# EAGLE schematic fmc (EAGLE 9.3.2)
CREVISION: v0a; DESIGNER: Rafael Silva

## Sheet 1 of 5: Main Controller
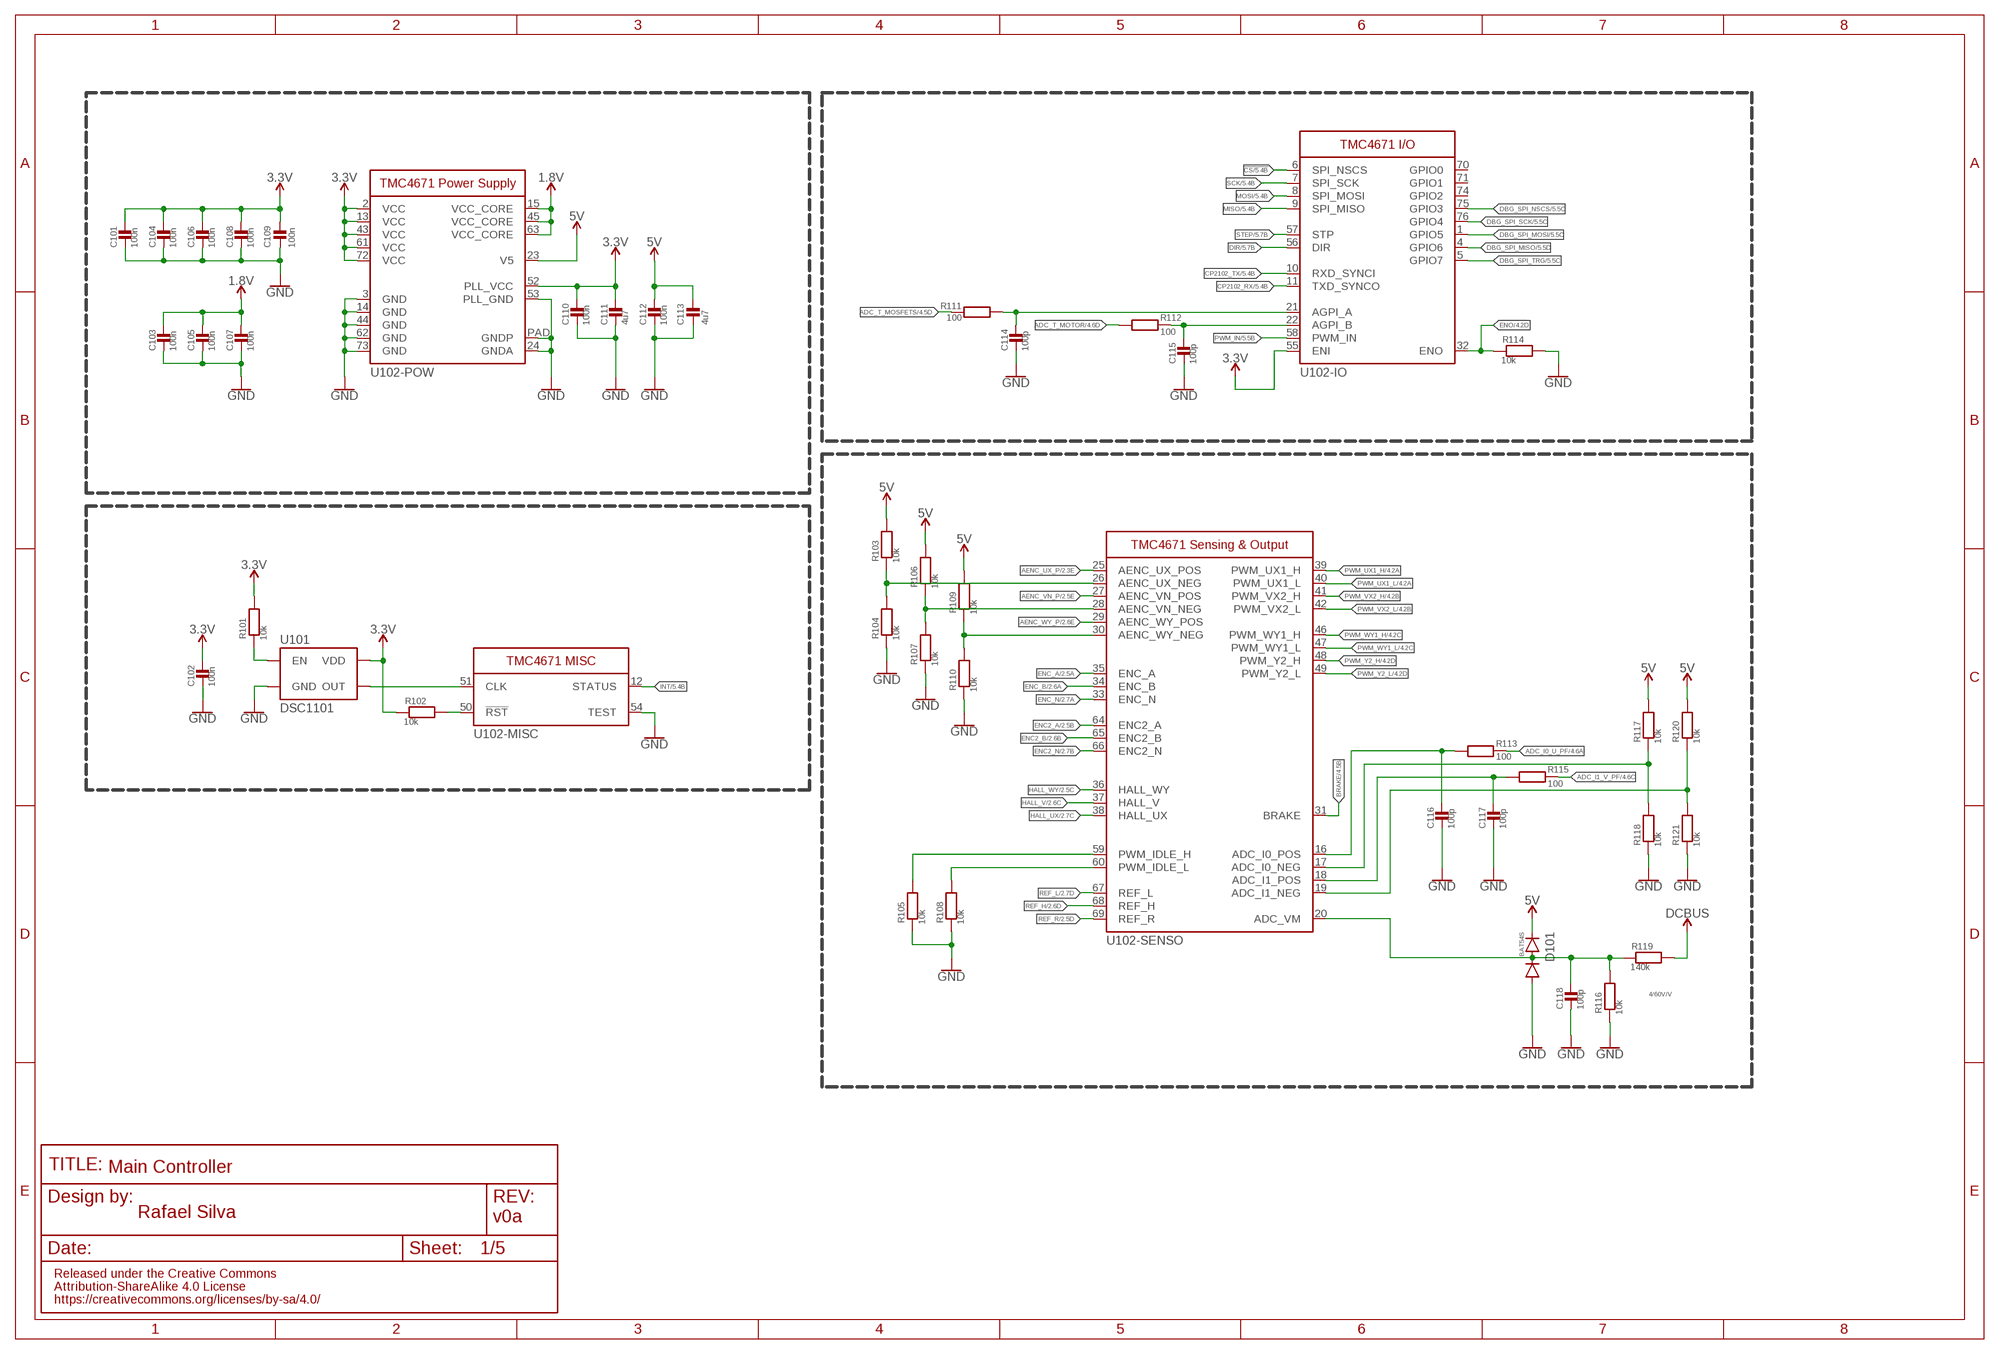
[diagram p0: schematic, sheet 1]

### Parts
C101  100n  MLCC0603  [0603_WAVE]
C102  100n  MLCC0603  [0603_WAVE]
C103  100n  MLCC0603  [0603_WAVE]
C104  100n  MLCC0603  [0603_WAVE]
C105  100n  MLCC0603  [0603_WAVE]
C106  100n  MLCC0603  [0603_WAVE]
C107  100n  MLCC0603  [0603_WAVE]
C108  100n  MLCC0603  [0603_WAVE]
C109  100n  MLCC0603  [0603_WAVE]
C110  100n  MLCC0603  [0603_WAVE]
C111  4u7  MLCC0603  [0603_WAVE]
C112  100n  MLCC0603  [0603_WAVE]
C113  4u7  MLCC0603  [0603_WAVE]
C114  100p  MLCC0603  [0603_WAVE]
C115  100p  MLCC0603  [0603_WAVE]
C116  100p  MLCC0603  [0603_WAVE]
C117  100p  MLCC0603  [0603_WAVE]
C118  100p  MLCC0603  [0603_WAVE]
D101  BAT54S  [SOT-23-3]
R101  10k  RESISTOR0603  [0603_WAVE]
R102  10k  RESISTOR0603  [0603_WAVE]
R103  10k  RESISTOR0603  [0603_WAVE]
R104  10k  RESISTOR0603  [0603_WAVE]
R105  10k  RESISTOR0603  [0603_WAVE]
R106  10k  RESISTOR0603  [0603_WAVE]
R107  10k  RESISTOR0603  [0603_WAVE]
R108  10k  RESISTOR0603  [0603_WAVE]
R109  10k  RESISTOR0603  [0603_WAVE]
R110  10k  RESISTOR0603  [0603_WAVE]
R111  100  RESISTOR0603  [0603_WAVE]
R112  100  RESISTOR0603  [0603_WAVE]
R113  100  RESISTOR0603  [0603_WAVE]
R114  10k  RESISTOR0603  [0603_WAVE]
R115  100  RESISTOR0603  [0603_WAVE]
R116  10k  RESISTOR0603  [0603_WAVE]
R117  10k  RESISTOR0603  [0603_WAVE]
R118  10k  RESISTOR0603  [0603_WAVE]
R119  140k  RESISTOR0603  [0603_WAVE]
R120  10k  RESISTOR0603  [0603_WAVE]
R121  10k  RESISTOR0603  [0603_WAVE]
U101  DSC1101  [CDFN_5X3.2]
U102  TMC4671  [QFN76]

### Nets
1.8V: C103.P$1 C105.P$1 C107.P$1 U102.15(-POW:VCC_CORE) U102.45(-POW:VCC_CORE) U102.63(-POW:VCC_CORE)
3.3V: C101.P$1 C102.P$1 C104.P$1 C106.P$1 C108.P$1 C109.P$1 C110.P$1 C111.P$1 R101.P$2 R102.P$1 U101.6(VDD) U102.2(-POW:VCC) U102.13(-POW:VCC) U102.43(-POW:VCC) U102.52(-POW:PLL_VCC) U102.55(-IO:ENI) U102.61(-POW:VCC) U102.72(-POW:VCC) ; also sheet 2,3,4,5
5V: C112.P$1 C113.P$1 D101.P$2 R103.P$2 R106.P$2 R109.P$2 R117.P$2 R120.P$2 U102.23(-POW:V5) ; also sheet 2,3,4
!CS: U102.6(-IO:SPI_NSCS) ; also sheet 5
ADC_I0_U_PF: R113.P$2 ; also sheet 4
ADC_I1_V_PF: R115.P$2 ; also sheet 4
ADC_T_MOSFETS: R111.P$2 ; also sheet 4
ADC_T_MOTOR: R112.P$1 ; also sheet 4
AENC_UX_P: U102.25(-SENSO:AENC_UX_POS) ; also sheet 2
AENC_VN_P: U102.27(-SENSO:AENC_VN_POS) ; also sheet 2
AENC_WY_P: U102.29(-SENSO:AENC_WY_POS) ; also sheet 2
BRAKE: U102.31(-SENSO:BRAKE) ; also sheet 4
CP2102_RX: U102.11(-IO:TXD_SYNCO) ; also sheet 5
CP2102_TX: U102.10(-IO:RXD_SYNCI) ; also sheet 5
DBG_SPI_MISO: U102.4(-IO:GPIO6) ; also sheet 5
DBG_SPI_MOSI: U102.1(-IO:GPIO5) ; also sheet 5
DBG_SPI_NSCS: U102.75(-IO:GPIO3) ; also sheet 5
DBG_SPI_SCK: U102.76(-IO:GPIO4) ; also sheet 5
DBG_SPI_TRG: U102.5(-IO:GPIO7) ; also sheet 5
DCBUS: R119.P$2 ; also sheet 3,4
DIR: U102.56(-IO:DIR) ; also sheet 5
ENC2_A: U102.64(-SENSO:ENC2_A) ; also sheet 2
ENC2_B: U102.65(-SENSO:ENC2_B) ; also sheet 2
ENC2_N: U102.66(-SENSO:ENC2_N) ; also sheet 2
ENC_A: U102.35(-SENSO:ENC_A) ; also sheet 2
ENC_B: U102.34(-SENSO:ENC_B) ; also sheet 2
ENC_N: U102.33(-SENSO:ENC_N) ; also sheet 2
ENO: R114.P$1 U102.32(-IO:ENO) ; also sheet 4
GND: C101.P$2 C102.P$2 C103.P$2 C104.P$2 C105.P$2 C106.P$2 C107.P$2 C108.P$2 C109.P$2 C110.P$2 C111.P$2 C112.P$2 C113.P$2 C114.P$2 C115.P$2 C116.P$2 C117.P$2 C118.P$2 D101.P$1 R104.P$1 R105.P$1 R107.P$1 R108.P$1 R110.P$1 R114.P$2 R116.P$1 R118.P$1 R121.P$1 U101.3(GND) U102.3(-POW:GND) U102.14(-POW:GND) U102.24(-POW:GNDA) U102.44(-POW:GND) U102.53(-POW:PLL_GND) U102.54(-MISC:TEST) U102.62(-POW:GND) U102.73(-POW:GND) U102.PAD(-POW:GNDP) ; also sheet 2,3,4,5
HALL_UX: U102.38(-SENSO:HALL_UX) ; also sheet 2
HALL_V: U102.37(-SENSO:HALL_V) ; also sheet 2
HALL_WY: U102.36(-SENSO:HALL_WY) ; also sheet 2
INT: U102.12(-MISC:STATUS) ; also sheet 5
MISO: U102.9(-IO:SPI_MISO) ; also sheet 5
MOSI: U102.8(-IO:SPI_MOSI) ; also sheet 5
N$2: C116.P$1 R113.P$1 U102.16(-SENSO:ADC_I0_POS)
N$38: R108.P$2 U102.60(-SENSO:PWM_IDLE_L)
N$39: R105.P$2 U102.59(-SENSO:PWM_IDLE_H)
N$41: U101.4(OUT) U102.51(-MISC:CLK)
N$42: R102.P$2 U102.50(-MISC:!RST!)
N$44: R101.P$1 U101.1(EN)
N$51: C117.P$1 R115.P$1 U102.18(-SENSO:ADC_I1_POS)
N$52: R117.P$1 R118.P$2 U102.17(-SENSO:ADC_I0_NEG)
N$53: R120.P$1 R121.P$2 U102.19(-SENSO:ADC_I1_NEG)
N$54: C118.P$1 D101.P$3 R116.P$2 R119.P$1 U102.20(-SENSO:ADC_VM)
N$92: C114.P$1 R111.P$1 U102.21(-IO:AGPI_A)
N$93: C115.P$1 R112.P$2 U102.22(-IO:AGPI_B)
N$94: R109.P$1 R110.P$2 U102.30(-SENSO:AENC_WY_NEG)
N$95: R106.P$1 R107.P$2 U102.28(-SENSO:AENC_VN_NEG)
N$96: R103.P$1 R104.P$2 U102.26(-SENSO:AENC_UX_NEG)
PWM_IN: U102.58(-IO:PWM_IN) ; also sheet 5
PWM_UX1_H: U102.39(-SENSO:PWM_UX1_H) ; also sheet 4
PWM_UX1_L: U102.40(-SENSO:PWM_UX1_L) ; also sheet 4
PWM_VX2_H: U102.41(-SENSO:PWM_VX2_H) ; also sheet 4
PWM_VX2_L: U102.42(-SENSO:PWM_VX2_L) ; also sheet 4
PWM_WY1_H: U102.46(-SENSO:PWM_WY1_H) ; also sheet 4
PWM_WY1_L: U102.47(-SENSO:PWM_WY1_L) ; also sheet 4
PWM_Y2_H: U102.48(-SENSO:PWM_Y2_H) ; also sheet 4
PWM_Y2_L: U102.49(-SENSO:PWM_Y2_L) ; also sheet 4
REF_H: U102.68(-SENSO:REF_H) ; also sheet 2
REF_L: U102.67(-SENSO:REF_L) ; also sheet 2
REF_R: U102.69(-SENSO:REF_R) ; also sheet 2
SCK: U102.7(-IO:SPI_SCK) ; also sheet 5
STEP: U102.57(-IO:STP) ; also sheet 5
Unconnected: U102.70(-IO:GPIO0) U102.71(-IO:GPIO1) U102.74(-IO:GPIO2)

### Notes on the sheet
- 4/60V/V
- Main Controller

## Sheet 2 of 5: Feedback
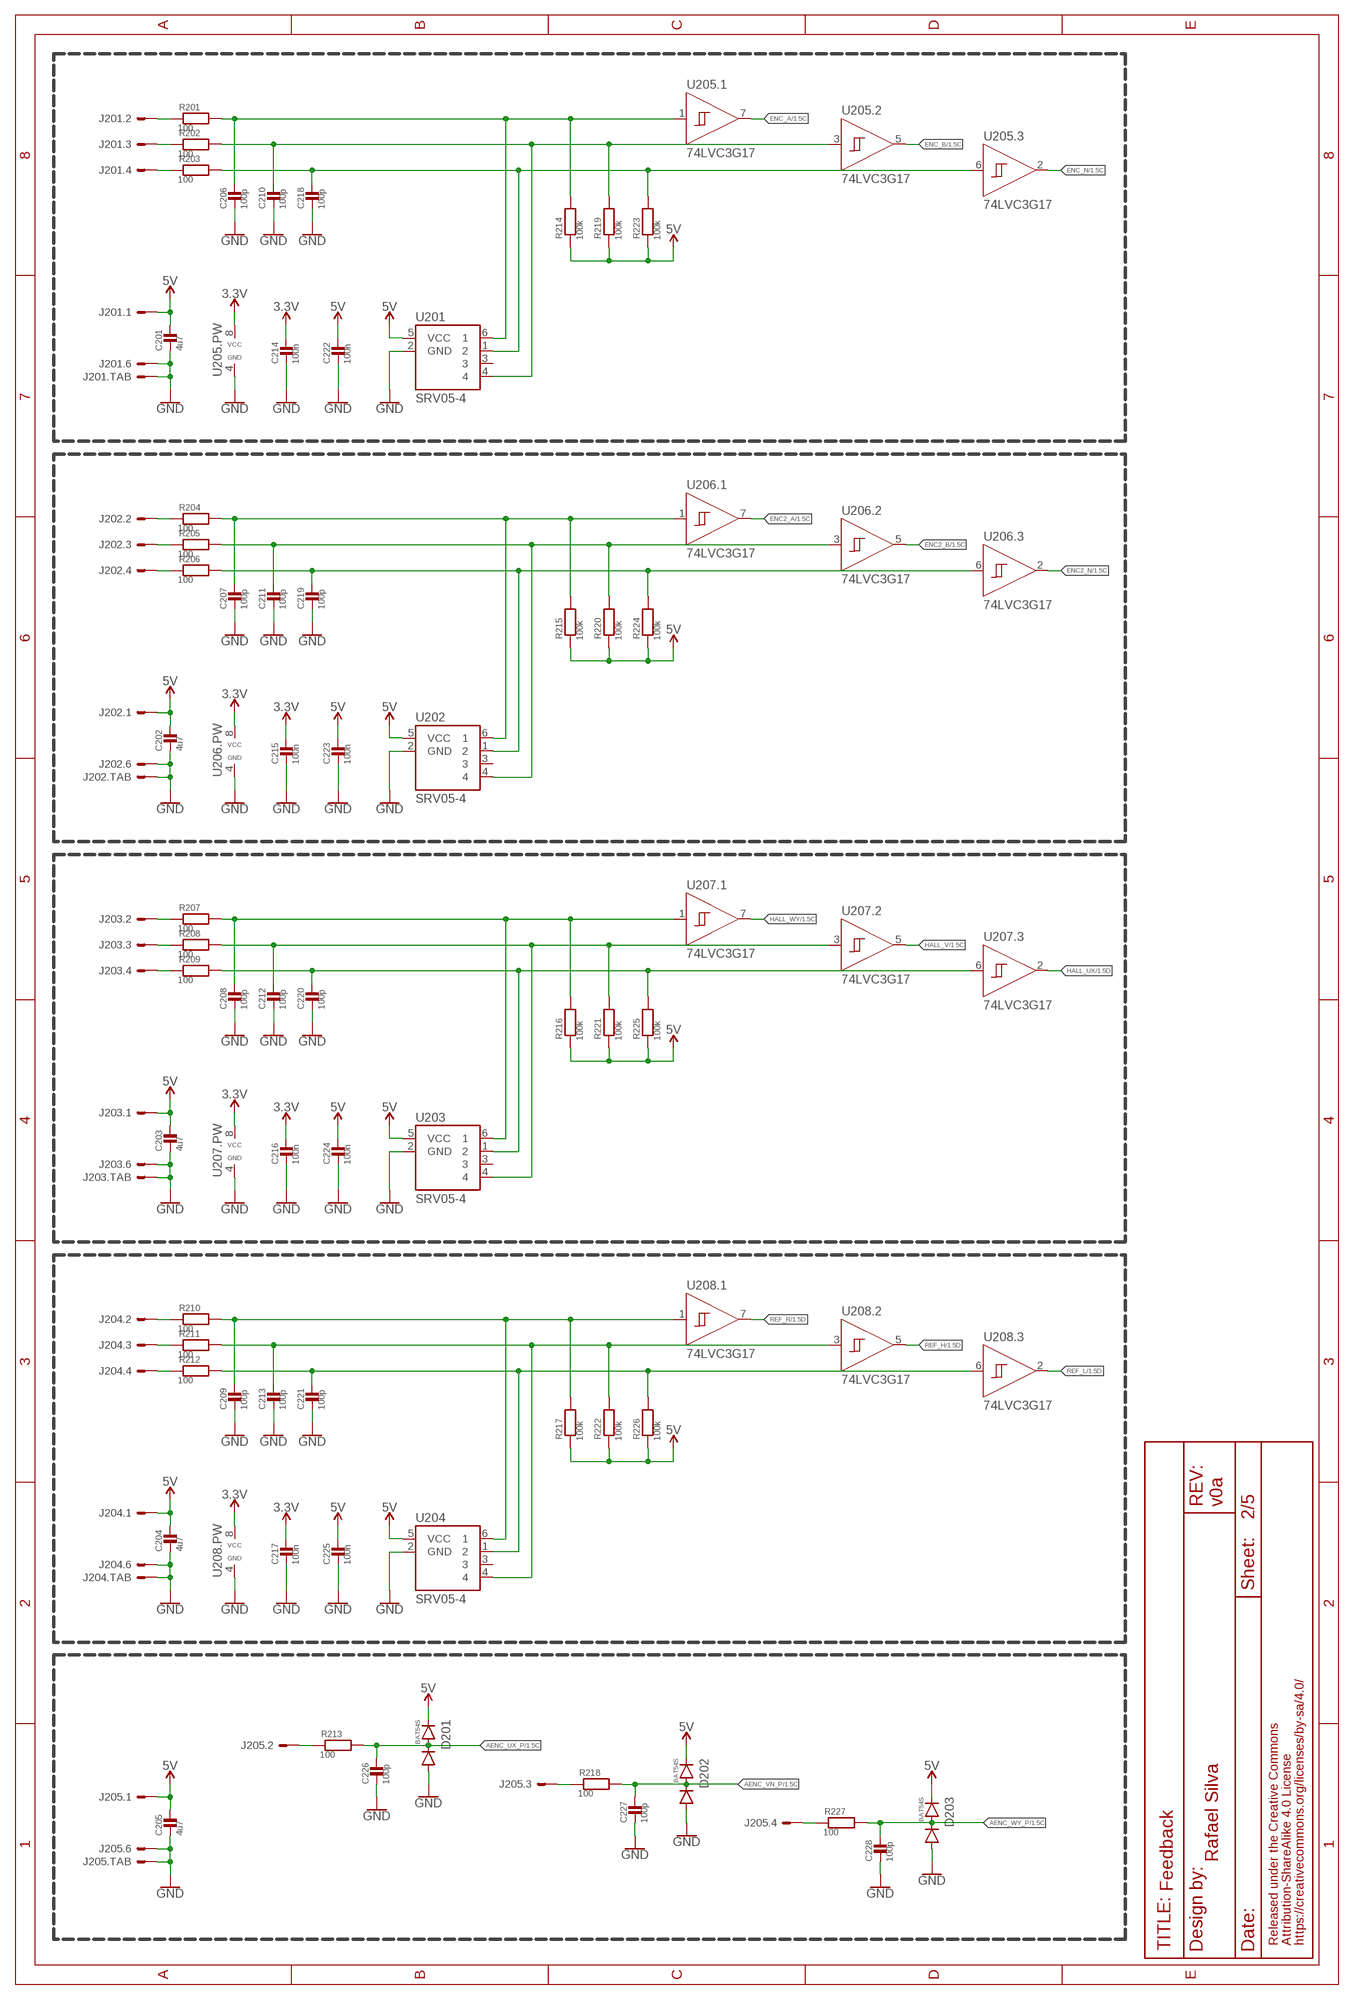
[diagram p1: schematic, sheet 2]

### Parts
C201  4u7  MLCC0603  [0603_WAVE]
C202  4u7  MLCC0603  [0603_WAVE]
C203  4u7  MLCC0603  [0603_WAVE]
C204  4u7  MLCC0603  [0603_WAVE]
C205  4u7  MLCC0603  [0603_WAVE]
C206  100p  MLCC0603  [0603_WAVE]
C207  100p  MLCC0603  [0603_WAVE]
C208  100p  MLCC0603  [0603_WAVE]
C209  100p  MLCC0603  [0603_WAVE]
C210  100p  MLCC0603  [0603_WAVE]
C211  100p  MLCC0603  [0603_WAVE]
C212  100p  MLCC0603  [0603_WAVE]
C213  100p  MLCC0603  [0603_WAVE]
C214  100n  MLCC0603  [0603_WAVE]
C215  100n  MLCC0603  [0603_WAVE]
C216  100n  MLCC0603  [0603_WAVE]
C217  100n  MLCC0603  [0603_WAVE]
C218  100p  MLCC0603  [0603_WAVE]
C219  100p  MLCC0603  [0603_WAVE]
C220  100p  MLCC0603  [0603_WAVE]
C221  100p  MLCC0603  [0603_WAVE]
C222  100n  MLCC0603  [0603_WAVE]
C223  100n  MLCC0603  [0603_WAVE]
C224  100n  MLCC0603  [0603_WAVE]
C225  100n  MLCC0603  [0603_WAVE]
C226  100p  MLCC0603  [0603_WAVE]
C227  100p  MLCC0603  [0603_WAVE]
C228  100p  MLCC0603  [0603_WAVE]
D201  BAT54S  [SOT-23-3]
D202  BAT54S  [SOT-23-3]
D203  BAT54S  [SOT-23-3]
J201  SH-5  [SM05B-SSR-H-TB]
J202  SH-5  [SM05B-SSR-H-TB]
J203  SH-5  [SM05B-SSR-H-TB]
J204  SH-5  [SM05B-SSR-H-TB]
J205  SH-5  [SM05B-SSR-H-TB]
R201  100  RESISTOR0603  [0603_WAVE]
R202  100  RESISTOR0603  [0603_WAVE]
R203  100  RESISTOR0603  [0603_WAVE]
R204  100  RESISTOR0603  [0603_WAVE]
R205  100  RESISTOR0603  [0603_WAVE]
R206  100  RESISTOR0603  [0603_WAVE]
R207  100  RESISTOR0603  [0603_WAVE]
R208  100  RESISTOR0603  [0603_WAVE]
R209  100  RESISTOR0603  [0603_WAVE]
R210  100  RESISTOR0603  [0603_WAVE]
R211  100  RESISTOR0603  [0603_WAVE]
R212  100  RESISTOR0603  [0603_WAVE]
R213  100  RESISTOR0603  [0603_WAVE]
R214  100k  RESISTOR0603  [0603_WAVE]
R215  100k  RESISTOR0603  [0603_WAVE]
R216  100k  RESISTOR0603  [0603_WAVE]
R217  100k  RESISTOR0603  [0603_WAVE]
R218  100  RESISTOR0603  [0603_WAVE]
R219  100k  RESISTOR0603  [0603_WAVE]
R220  100k  RESISTOR0603  [0603_WAVE]
R221  100k  RESISTOR0603  [0603_WAVE]
R222  100k  RESISTOR0603  [0603_WAVE]
R223  100k  RESISTOR0603  [0603_WAVE]
R224  100k  RESISTOR0603  [0603_WAVE]
R225  100k  RESISTOR0603  [0603_WAVE]
R226  100k  RESISTOR0603  [0603_WAVE]
R227  100  RESISTOR0603  [0603_WAVE]
U201  SRV05-4  [SOT23-6]
U202  SRV05-4  [SOT23-6]
U203  SRV05-4  [SOT23-6]
U204  SRV05-4  [SOT23-6]
U205  74LVC3G17  [TSSOP-8]
U206  74LVC3G17  [TSSOP-8]
U207  74LVC3G17  [TSSOP-8]
U208  74LVC3G17  [TSSOP-8]

### Nets
3.3V: C214.P$1 C215.P$1 C216.P$1 C217.P$1 U205.8(.PW:VCC) U206.8(.PW:VCC) U207.8(.PW:VCC) U208.8(.PW:VCC) ; also sheet 1,3,4,5
5V: C201.P$1 C202.P$1 C203.P$1 C204.P$1 C205.P$1 C222.P$1 C223.P$1 C224.P$1 C225.P$1 D201.P$2 D202.P$2 D203.P$2 J201.1 J202.1 J203.1 J204.1 J205.1 R214.P$1 R215.P$1 R216.P$1 R217.P$1 R219.P$1 R220.P$1 R221.P$1 R222.P$1 R223.P$1 R224.P$1 R225.P$1 R226.P$1 U201.5(VCC) U202.5(VCC) U203.5(VCC) U204.5(VCC) ; also sheet 1,3,4
AENC_UX@J: J205.2 R213.P$1
AENC_UX_P: C226.P$1 D201.P$3 R213.P$2 ; also sheet 1
AENC_VN@J: J205.3 R218.P$1
AENC_VN_P: C227.P$1 D202.P$3 R218.P$2 ; also sheet 1
AENC_WY@J: J205.4 R227.P$1
AENC_WY_P: C228.P$1 D203.P$3 R227.P$2 ; also sheet 1
ENC2_A: U206.7(.1:Y) ; also sheet 1
ENC2_B: U206.5(.2:Y) ; also sheet 1
ENC2_N: U206.2(.3:Y) ; also sheet 1
ENC_2_A@J: J202.2 R204.P$1
ENC_2_B@J: J202.3 R205.P$1
ENC_2_N@J: J202.4 R206.P$1
ENC_A: U205.7(.1:Y) ; also sheet 1
ENC_A@J: J201.2 R201.P$1
ENC_B: U205.5(.2:Y) ; also sheet 1
ENC_B@J: J201.3 R202.P$1
ENC_N: U205.2(.3:Y) ; also sheet 1
ENC_N@J: J201.4 R203.P$1
GND: C201.P$2 C202.P$2 C203.P$2 C204.P$2 C205.P$2 C206.P$2 C207.P$2 C208.P$2 C209.P$2 C210.P$2 C211.P$2 C212.P$2 C213.P$2 C214.P$2 C215.P$2 C216.P$2 C217.P$2 C218.P$2 C219.P$2 C220.P$2 C221.P$2 C222.P$2 C223.P$2 C224.P$2 C225.P$2 C226.P$2 C227.P$2 C228.P$2 D201.P$1 D202.P$1 D203.P$1 J201.5 J201.FIT@1 J201.FIT@2 J202.5 J202.FIT@1 J202.FIT@2 J203.5 J203.FIT@1 J203.FIT@2 J204.5 J204.FIT@1 J204.FIT@2 J205.5 J205.FIT@1 J205.FIT@2 U201.2(GND) U202.2(GND) U203.2(GND) U204.2(GND) U205.4(.PW:GND) U206.4(.PW:GND) U207.4(.PW:GND) U208.4(.PW:GND) ; also sheet 1,3,4,5
HALL_UX: U207.2(.3:Y) ; also sheet 1
HALL_UX@J: J203.4 R209.P$1
HALL_V: U207.5(.2:Y) ; also sheet 1
HALL_V@J: J203.3 R208.P$1
HALL_WY: U207.7(.1:Y) ; also sheet 1
HALL_WY@J: J203.2 R207.P$1
N$67: C218.P$1 R203.P$2 R223.P$2 U201.1 U205.6(.3:A)
N$69: C210.P$1 R202.P$2 R219.P$2 U201.4 U205.3(.2:A)
N$70: C219.P$1 R206.P$2 R224.P$2 U202.1 U206.6(.3:A)
N$74: C206.P$1 R201.P$2 R214.P$2 U201.6 U205.1(.1:A)
N$75: C211.P$1 R205.P$2 R220.P$2 U202.4 U206.3(.2:A)
N$79: C207.P$1 R204.P$2 R215.P$2 U202.6 U206.1(.1:A)
N$80: C220.P$1 R209.P$2 R225.P$2 U203.1 U207.6(.3:A)
N$81: C212.P$1 R208.P$2 R221.P$2 U203.4 U207.3(.2:A)
N$85: C208.P$1 R207.P$2 R216.P$2 U203.6 U207.1(.1:A)
N$86: C221.P$1 R212.P$2 R226.P$2 U204.1 U208.6(.3:A)
N$87: C213.P$1 R211.P$2 R222.P$2 U204.4 U208.3(.2:A)
N$91: C209.P$1 R210.P$2 R217.P$2 U204.6 U208.1(.1:A)
REF_H: U208.5(.2:Y) ; also sheet 1
REF_H@J: J204.3 R211.P$1
REF_L: U208.2(.3:Y) ; also sheet 1
REF_L@J: J204.4 R212.P$1
REF_R: U208.7(.1:Y) ; also sheet 1
REF_R@J: J204.2 R210.P$1
Unconnected: U201.3 U202.3 U203.3 U204.3

### Notes on the sheet
- Feedback

## Sheet 3 of 5: Power Management
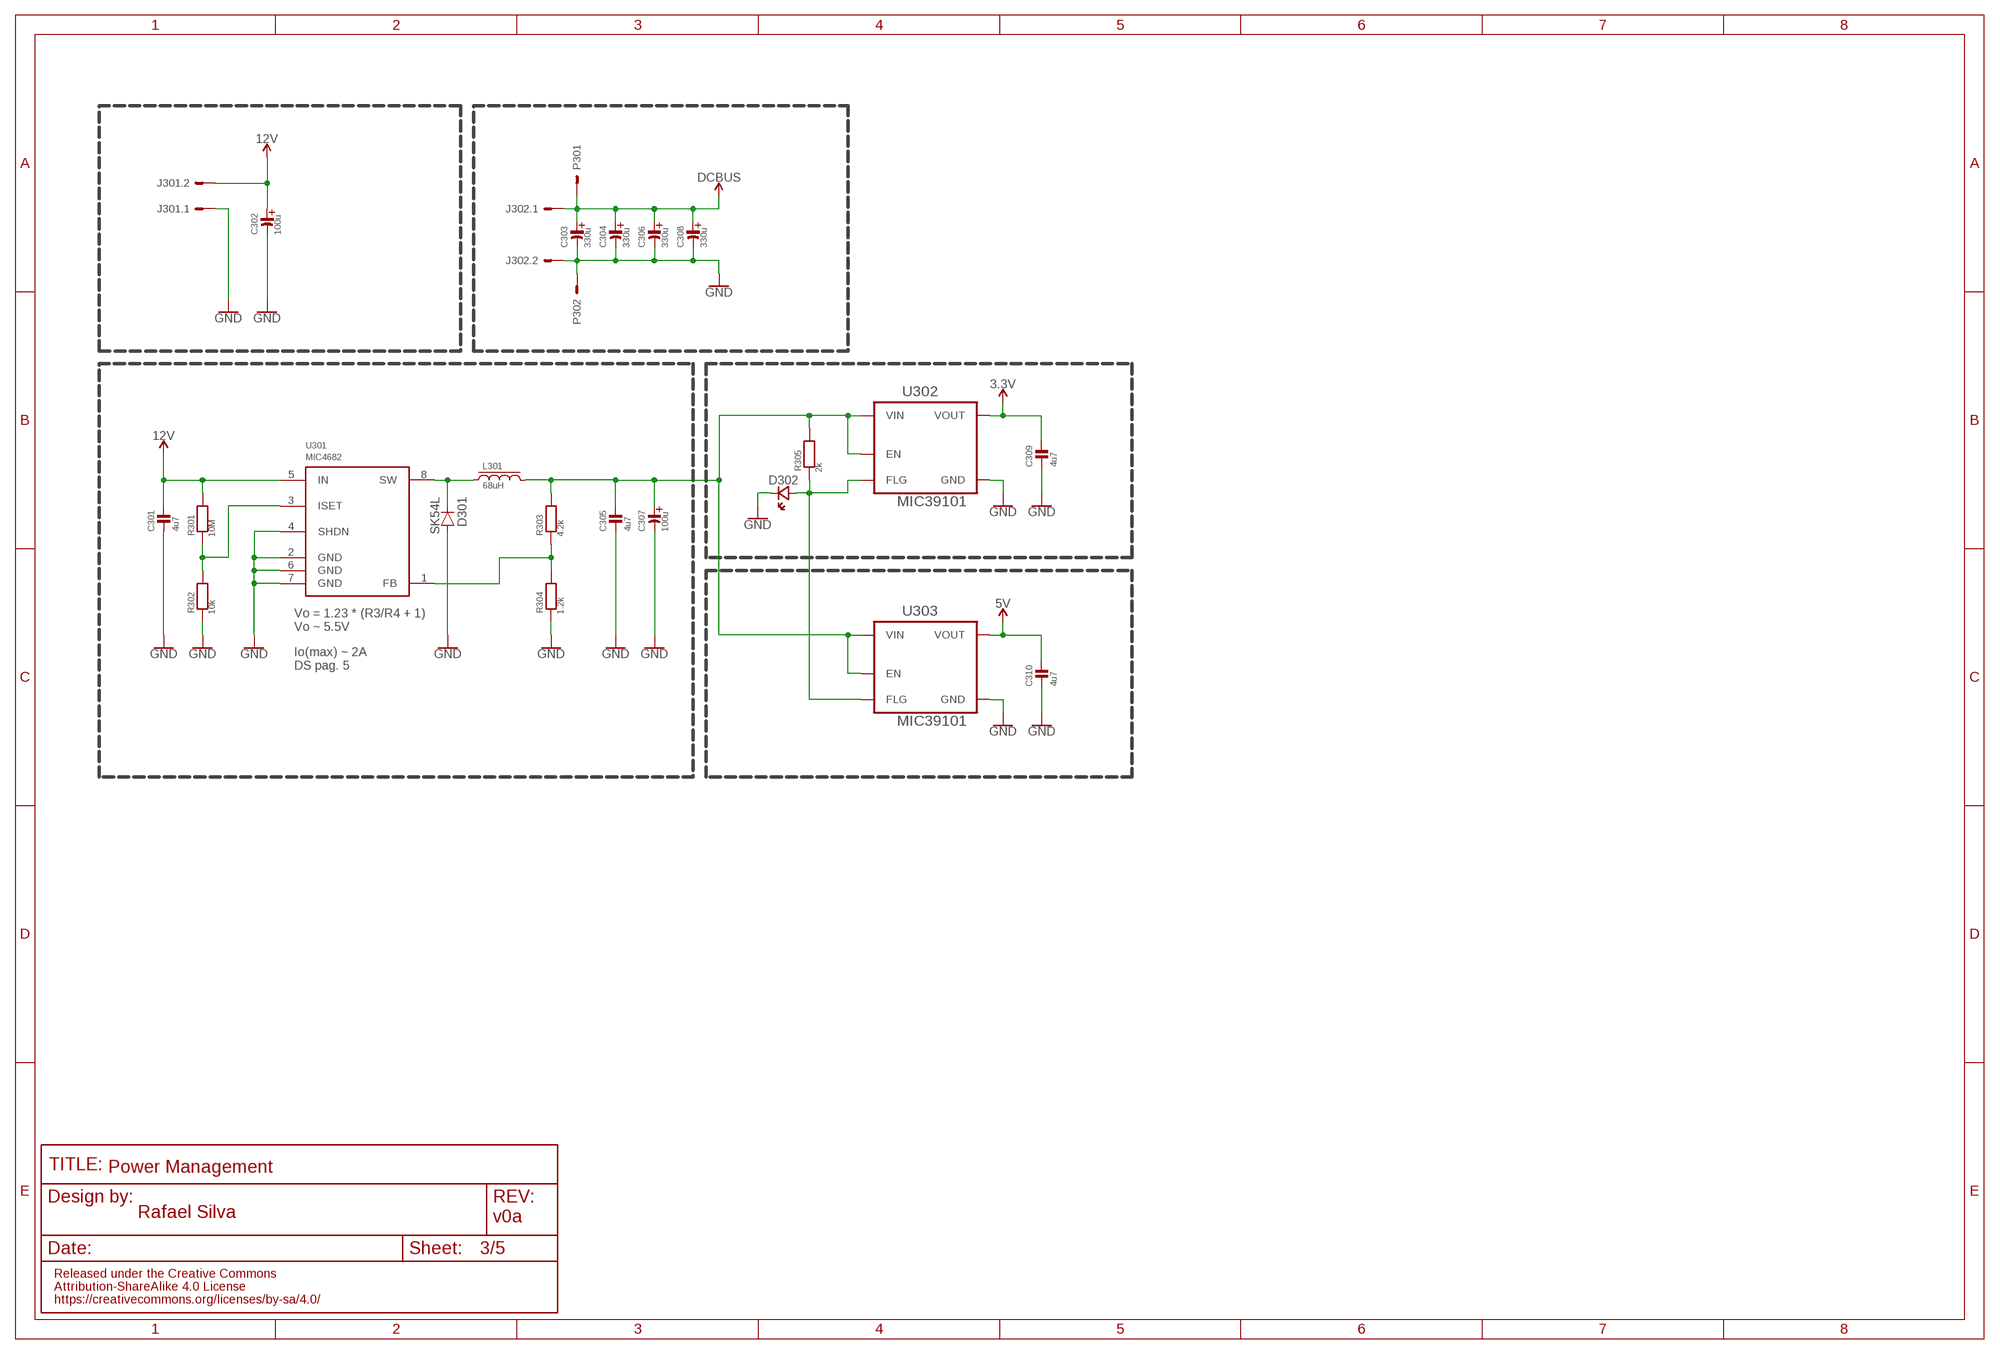
[diagram p2: schematic, sheet 3]

### Parts
C301  4u7  MLCC0603  [0603_WAVE]
C302  100u  CAPACITOR_ELD  [PANASONIC_D]
C303  330u  CAPACITOR_ELG  [PANASONIC_G]
C304  330u  CAPACITOR_ELG  [PANASONIC_G]
C305  4u7  MLCC0603  [0603_WAVE]
C306  330u  CAPACITOR_ELG  [PANASONIC_G]
C307  100u  CAPACITOR_ELD  [PANASONIC_D]
C308  330u  CAPACITOR_ELG  [PANASONIC_G]
C309  4u7  MLCC0603  [0603_WAVE]
C310  4u7  MLCC0603  [0603_WAVE]
D301  SK54L  [DO214AA]
D302  LED0603  [CHIPLED_0603]
J301  2P-6.35P  [2P-6.35P]
J302  2P-6.35P  [2P-6.35P]
L301  68uH  INDUCTORCDRH104R  [CDRH104R]
P301  POWPAD  [TH-HP]
P302  POWPAD  [TH-HP]
R301  10M  RESISTOR0603  [0603_WAVE]
R302  10k  RESISTOR0603  [0603_WAVE]
R303  4.2k  RESISTOR0603  [0603_WAVE]
R304  1.2k  RESISTOR0603  [0603_WAVE]
R305  2k  RESISTOR0603  [0603_WAVE]
U301  MIC4682  [SOIC8]
U302  MIC39101  [SOIC8]
U303  MIC39101  [SOIC8]

### Nets
3.3V: C309.P$1 U302.3(VOUT) ; also sheet 1,2,4,5
5V: C310.P$1 U303.3(VOUT) ; also sheet 1,2,4
12V: C301.P$1 C302.+(AN) J301.2 R301.P$2 U301.5(IN) ; also sheet 4
DCBUS: C303.+(AN) C304.+(AN) C306.+(AN) C308.+(AN) J302.1 P301.H1(S) P301.H2(S) P301.H3(S) P301.H4(S) P301.H5(S) P301.H6(S) P301.H7(S) P301.H8(S) P301.H9(S) P301.H10(S) P301.H11(S) P301.H12(S) P301.PAD(S) ; also sheet 1,4
GND: C301.P$2 C302.-(CA) C303.-(CA) C304.-(CA) C305.P$2 C306.-(CA) C307.-(CA) C308.-(CA) C309.P$2 C310.P$2 D301.A D302.C(CA) J301.1 J302.2 P302.H1(S) P302.H2(S) P302.H3(S) P302.H4(S) P302.H5(S) P302.H6(S) P302.H7(S) P302.H8(S) P302.H9(S) P302.H10(S) P302.H11(S) P302.H12(S) P302.PAD(S) R302.P$1 R304.P$1 U301.2(GND) U301.4(SHDN) U301.6(GND) U301.7(GND) U302.5(GND) U302.6(GND) U302.7(GND) U302.8(GND) U303.5(GND) U303.6(GND) U303.7(GND) U303.8(GND) ; also sheet 1,2,4,5
N$5: C305.P$1 C307.+(AN) L301.2 R303.P$2 R305.P$2 U302.1(EN) U302.2(VIN) U303.1(EN) U303.2(VIN)
N$45: D301.C L301.1 U301.8(SW)
N$46: R303.P$1 R304.P$2 U301.1(FB)
N$47: R301.P$1 R302.P$2 U301.3(ISET)
N$104: D302.A(AN) R305.P$1 U302.4(FLG) U303.4(FLG)

### Notes on the sheet
- Vo = 1.23 * (R3/R4 + 1)
  Vo ~ 5.5V
- Io(max) ~ 2A
  DS pag. 5
- Power Management

## Sheet 4 of 5: Power Stage
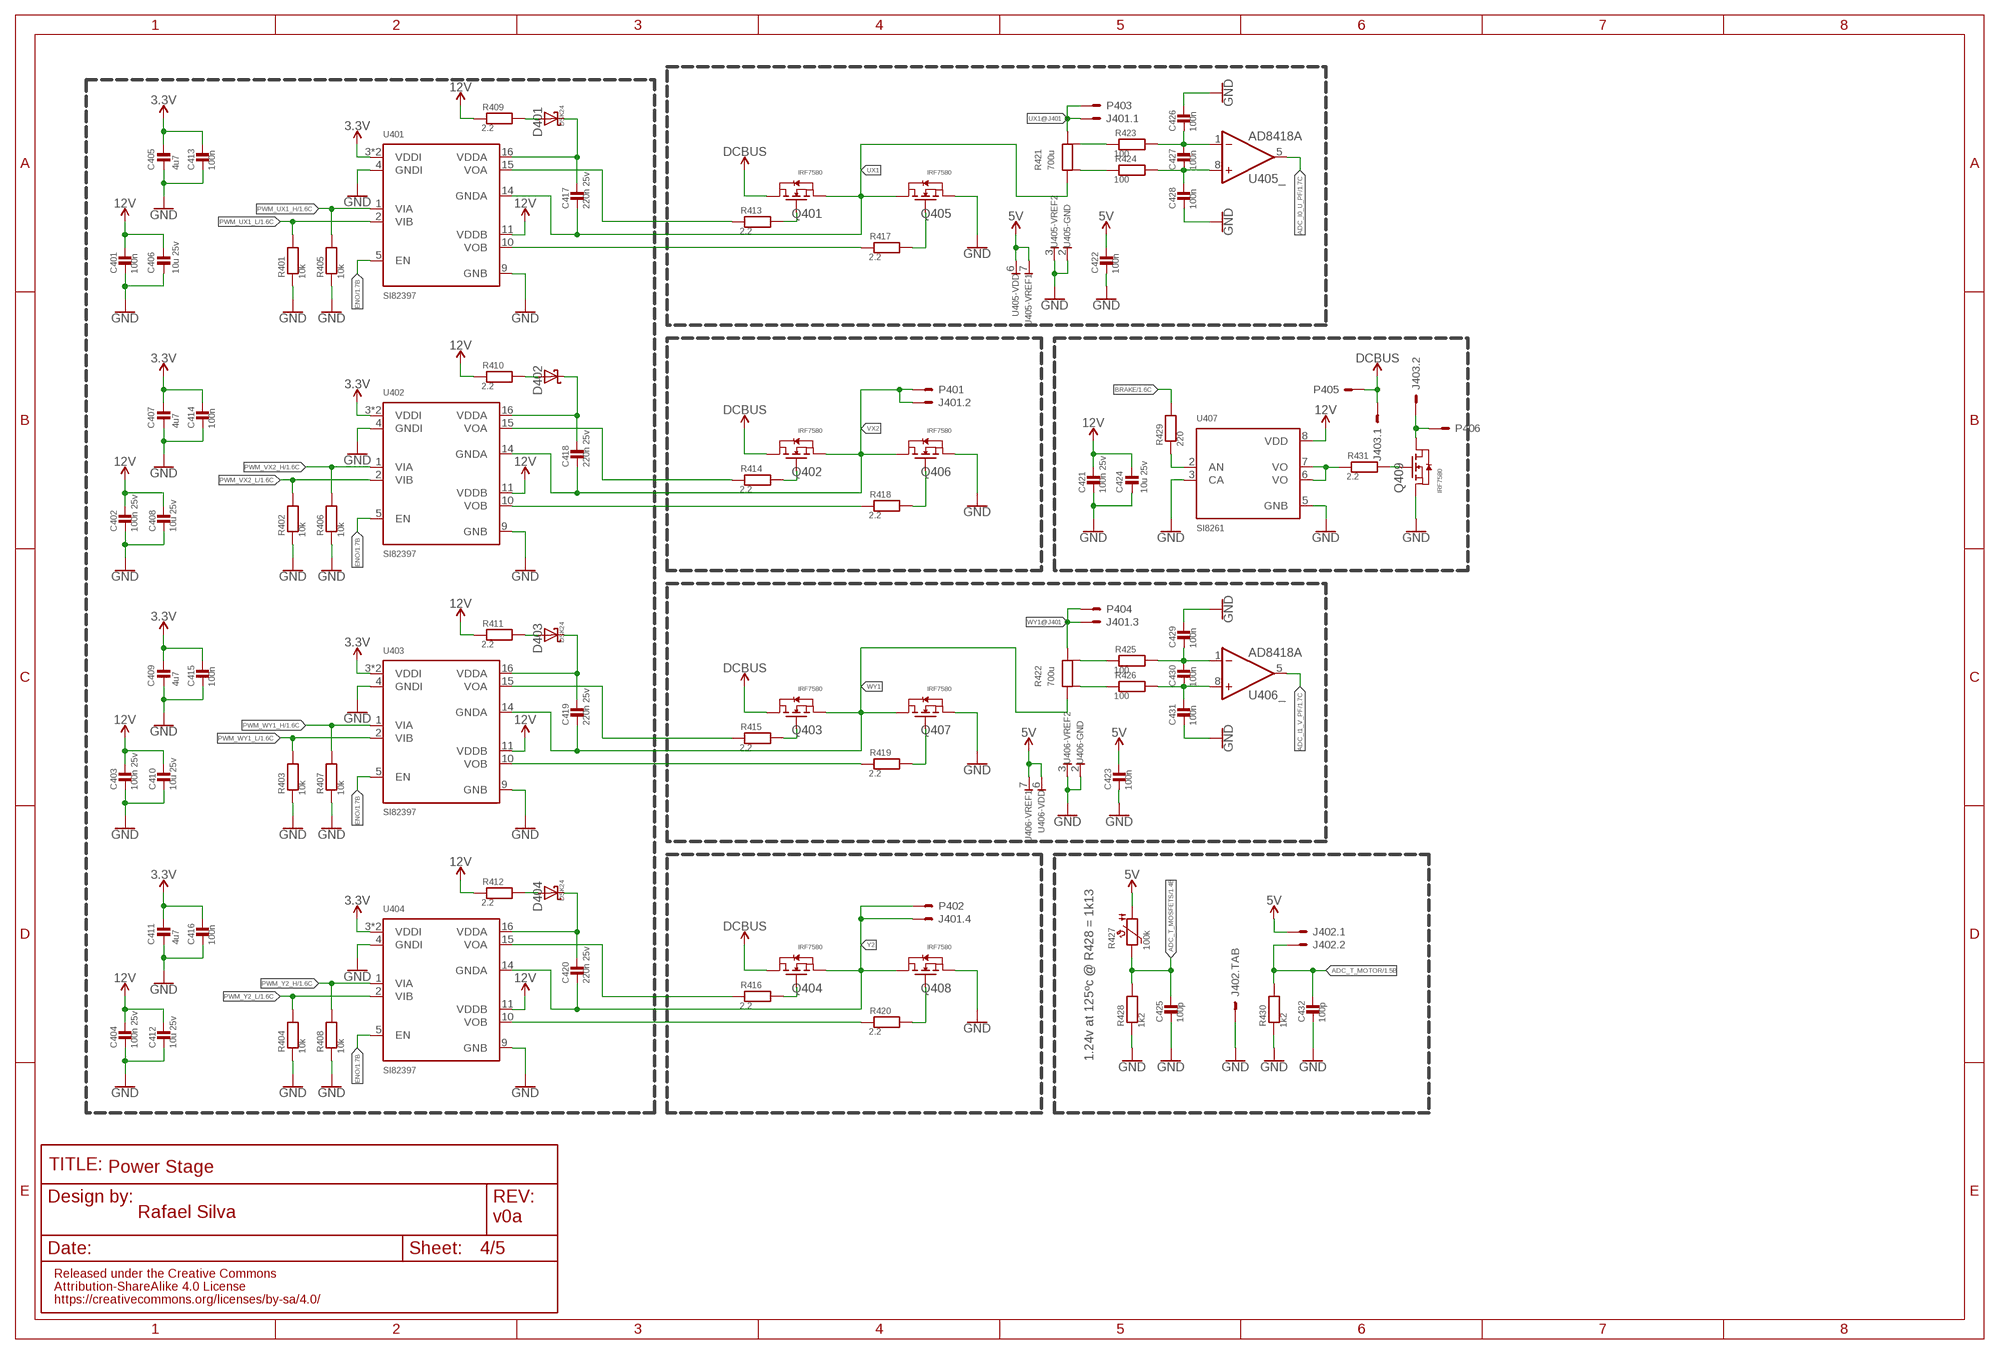
[diagram p3: schematic, sheet 4]

### Parts
C401  100n  MLCC0603  [0603_WAVE]
C402  100n 25v  MLCC0603  [0603_WAVE]
C403  100n 25v  MLCC0603  [0603_WAVE]
C404  100n 25v  MLCC0603  [0603_WAVE]
C405  4u7  MLCC0603  [0603_WAVE]
C406  10u 25v  MLCC0603  [0603_WAVE]
C407  4u7  MLCC0603  [0603_WAVE]
C408  10u 25v  MLCC0603  [0603_WAVE]
C409  4u7  MLCC0603  [0603_WAVE]
C410  10u 25v  MLCC0603  [0603_WAVE]
C411  4u7  MLCC0603  [0603_WAVE]
C412  10u 25v  MLCC0603  [0603_WAVE]
C413  100n  MLCC0603  [0603_WAVE]
C414  100n  MLCC0603  [0603_WAVE]
C415  100n  MLCC0603  [0603_WAVE]
C416  100n  MLCC0603  [0603_WAVE]
C417  220n 25v  MLCC0603  [0603_WAVE]
C418  220n 25v  MLCC0603  [0603_WAVE]
C419  220n 25v  MLCC0603  [0603_WAVE]
C420  220n 25v  MLCC0603  [0603_WAVE]
C421  100n 25v  MLCC0603  [0603_WAVE]
C422  100n  MLCC0603  [0603_WAVE]
C423  100n  MLCC0603  [0603_WAVE]
C424  10u 25v  MLCC0603  [0603_WAVE]
C425  100p  MLCC0603  [0603_WAVE]
C426  100n  MLCC0603  [0603_WAVE]
C427  100n  MLCC0603  [0603_WAVE]
C428  100n  MLCC0603  [0603_WAVE]
C429  100n  MLCC0603  [0603_WAVE]
C430  100n  MLCC0603  [0603_WAVE]
C431  100n  MLCC0603  [0603_WAVE]
C432  100p  MLCC0603  [0603_WAVE]
D401  DSK24  [SOD-123]
D402  DSK24  [SOD-123]
D403  DSK24  [SOD-123]
D404  DSK24  [SOD-123]
J401  4P-6.35P  [4P-6.35P]
J402  SH-2  [SM02B-SSR-H-TB]
J403  2P-6.35P  [2P-6.35P]
P401  POWPAD  [TH-HP]
P402  POWPAD  [TH-HP]
P403  POWPAD  [TH-HP]
P404  POWPAD  [TH-HP]
P405  POWPAD  [TH-HP]
P406  POWPAD  [TH-HP]
Q401  IRF7580  [DIRECTFET-ME]
Q402  IRF7580  [DIRECTFET-ME]
Q403  IRF7580  [DIRECTFET-ME]
Q404  IRF7580  [DIRECTFET-ME]
Q405  IRF7580  [DIRECTFET-ME]
Q406  IRF7580  [DIRECTFET-ME]
Q407  IRF7580  [DIRECTFET-ME]
Q408  IRF7580  [DIRECTFET-ME]
Q409  IRF7580  [DIRECTFET-ME]
R401  10k  RESISTOR0603  [0603_WAVE]
R402  10k  RESISTOR0603  [0603_WAVE]
R403  10k  RESISTOR0603  [0603_WAVE]
R404  10k  RESISTOR0603  [0603_WAVE]
R405  10k  RESISTOR0603  [0603_WAVE]
R406  10k  RESISTOR0603  [0603_WAVE]
R407  10k  RESISTOR0603  [0603_WAVE]
R408  10k  RESISTOR0603  [0603_WAVE]
R409  2.2  RESISTOR0603  [0603_WAVE]
R410  2.2  RESISTOR0603  [0603_WAVE]
R411  2.2  RESISTOR0603  [0603_WAVE]
R412  2.2  RESISTOR0603  [0603_WAVE]
R413  2.2  RESISTOR0603  [0603_WAVE]
R414  2.2  RESISTOR0603  [0603_WAVE]
R415  2.2  RESISTOR0603  [0603_WAVE]
R416  2.2  RESISTOR0603  [0603_WAVE]
R417  2.2  RESISTOR0603  [0603_WAVE]
R418  2.2  RESISTOR0603  [0603_WAVE]
R419  2.2  RESISTOR0603  [0603_WAVE]
R420  2.2  RESISTOR0603  [0603_WAVE]
R421  700u  LRMAP3920  [3920]
R422  700u  LRMAP3920  [3920]
R423  100  RESISTOR0603  [0603_WAVE]
R424  100  RESISTOR0603  [0603_WAVE]
R425  100  RESISTOR0603  [0603_WAVE]
R426  100  RESISTOR0603  [0603_WAVE]
R427  100k  NTC0603  [0603_WAVE]
R428  1k2  RESISTOR0603  [0603_WAVE]
R429  220  RESISTOR0603  [0603_WAVE]
R430  1k2  RESISTOR0603  [0603_WAVE]
R431  2.2  RESISTOR0603  [0603_WAVE]
U401  SI82397  [SOIC-16-WB]
U402  SI82397  [SOIC-16-WB]
U403  SI82397  [SOIC-16-WB]
U404  SI82397  [SOIC-16-WB]
U405  AD8418A  [MSOP-8]
U406  AD8418A  [MSOP-8]
U407  SI8261  [SOIC_8]

### Nets
3.3V: C405.P$1 C407.P$1 C409.P$1 C411.P$1 C413.P$1 C414.P$1 C415.P$1 C416.P$1 U401.3(VDDI) U401.8(VDDI) U402.3(VDDI) U402.8(VDDI) U403.3(VDDI) U403.8(VDDI) U404.3(VDDI) U404.8(VDDI) ; also sheet 1,2,3,5
5V: C422.P$1 C423.P$1 J402.1 R427.P$2 U405.6 U405.7 U406.6 U406.7 ; also sheet 1,2,3
12V: C401.P$1 C402.P$1 C403.P$1 C404.P$1 C406.P$1 C408.P$1 C410.P$1 C412.P$1 C421.P$1 C424.P$1 R409.P$1 R410.P$1 R411.P$1 R412.P$1 U401.11(VDDB) U402.11(VDDB) U403.11(VDDB) U404.11(VDDB) U407.8(VDD) ; also sheet 3
ADC_I0_U_PF: U405.5(_:O) ; also sheet 1
ADC_I1_V_PF: U406.5(_:O) ; also sheet 1
ADC_T_MOSFETS: C425.P$1 R427.P$1 R428.P$2 ; also sheet 1
ADC_T_MOTOR: C432.P$1 J402.2 R430.P$2 ; also sheet 1
BRAKE: R429.P$2 ; also sheet 1
DCBUS: J403.1 P405.H1(S) P405.H2(S) P405.H3(S) P405.H4(S) P405.H5(S) P405.H6(S) P405.H7(S) P405.H8(S) P405.H9(S) P405.H10(S) P405.H11(S) P405.H12(S) P405.PAD(S) Q401.D1 Q401.D2(D1) Q401.D3(D1) Q401.D4(D1) Q402.D1 Q402.D2(D1) Q402.D3(D1) Q402.D4(D1) Q403.D1 Q403.D2(D1) Q403.D3(D1) Q403.D4(D1) Q404.D1 Q404.D2(D1) Q404.D3(D1) Q404.D4(D1) ; also sheet 1,3
ENO: U401.5(EN) U402.5(EN) U403.5(EN) U404.5(EN) ; also sheet 1
GND: C401.P$2 C402.P$2 C403.P$2 C404.P$2 C405.P$2 C406.P$2 C407.P$2 C408.P$2 C409.P$2 C410.P$2 C411.P$2 C412.P$2 C413.P$2 C414.P$2 C415.P$2 C416.P$2 C421.P$2 C422.P$2 C423.P$2 C424.P$2 C425.P$2 C426.P$1 C428.P$2 C429.P$1 C431.P$2 C432.P$2 J402.FIT@1 J402.FIT@2 Q405.S1 Q405.S2(S1) Q405.S3(S1) Q405.S4(S1) Q405.S5(S1) Q406.S1 Q406.S2(S1) Q406.S3(S1) Q406.S4(S1) Q406.S5(S1) Q407.S1 Q407.S2(S1) Q407.S3(S1) Q407.S4(S1) Q407.S5(S1) Q408.S1 Q408.S2(S1) Q408.S3(S1) Q408.S4(S1) Q408.S5(S1) Q409.S1 Q409.S2(S1) Q409.S3(S1) Q409.S4(S1) Q409.S5(S1) R401.P$1 R402.P$1 R403.P$1 R404.P$1 R405.P$1 R406.P$1 R407.P$1 R408.P$1 R428.P$1 R430.P$1 U401.4(GNDI) U401.9(GNB) U402.4(GNDI) U402.9(GNB) U403.4(GNDI) U403.9(GNB) U404.4(GNDI) U404.9(GNB) U405.2 U405.3 U406.2 U406.3 U407.3(CA) U407.5(GNB) ; also sheet 1,2,3,5
N$3: R413.P$1 U401.15(VOA)
N$4: Q405.G(G1) R417.P$2
N$6: R421.SENSE+ R424.P$1
N$7: C417.P$1 D401.C U401.16(VDDA)
N$8: R414.P$1 U402.15(VOA)
N$9: Q406.G(G1) R418.P$2
N$10: R421.SENSE- R423.P$1
N$11: C418.P$1 D402.C U402.16(VDDA)
N$12: R415.P$1 U403.15(VOA)
N$13: Q407.G(G1) R419.P$2
N$14: C426.P$2 C427.P$1 R423.P$2 U405.1(_:IN-)
N$15: C419.P$1 D403.C U403.16(VDDA)
N$16: R416.P$1 U404.15(VOA)
N$17: Q408.G(G1) R420.P$2
N$18: C427.P$2 C428.P$1 R424.P$2 U405.8(_:IN+)
N$19: C420.P$1 D404.C U404.16(VDDA)
N$20: Q403.G(G1) R415.P$2
N$21: Q401.G(G1) R413.P$2
N$22: Q402.G(G1) R414.P$2
N$23: Q404.G(G1) R416.P$2
N$24: R417.P$1 U401.10(VOB)
N$25: R418.P$1 U402.10(VOB)
N$26: R419.P$1 U403.10(VOB)
N$27: R420.P$1 U404.10(VOB)
N$40: D404.A R412.P$2
N$43: D403.A R411.P$2
N$48: D402.A R410.P$2
N$49: D401.A R409.P$2
N$55: R422.SENSE- R425.P$1
N$56: R422.SENSE+ R426.P$1
N$57: C430.P$2 C431.P$1 R426.P$2 U406.8(_:IN+)
N$58: C429.P$2 C430.P$1 R425.P$2 U406.1(_:IN-)
N$100: R429.P$1 U407.2(AN)
N$102: Q409.G(G1) R431.P$2
N$103: R431.P$1 U407.6(VO) U407.7(VO)
N$105: J403.2 P406.H1(S) P406.H2(S) P406.H3(S) P406.H4(S) P406.H5(S) P406.H6(S) P406.H7(S) P406.H8(S) P406.H9(S) P406.H10(S) P406.H11(S) P406.H12(S) P406.PAD(S) Q409.D1 Q409.D2(D1) Q409.D3(D1) Q409.D4(D1)
PWM_UX1_H: R405.P$2 U401.1(VIA) ; also sheet 1
PWM_UX1_L: R401.P$2 U401.2(VIB) ; also sheet 1
PWM_VX2_H: R406.P$2 U402.1(VIA) ; also sheet 1
PWM_VX2_L: R402.P$2 U402.2(VIB) ; also sheet 1
PWM_WY1_H: R407.P$2 U403.1(VIA) ; also sheet 1
PWM_WY1_L: R403.P$2 U403.2(VIB) ; also sheet 1
PWM_Y2_H: R408.P$2 U404.1(VIA) ; also sheet 1
PWM_Y2_L: R404.P$2 U404.2(VIB) ; also sheet 1
UX1: C417.P$2 Q401.S1 Q401.S2(S1) Q401.S3(S1) Q401.S4(S1) Q401.S5(S1) Q405.D1 Q405.D2(D1) Q405.D3(D1) Q405.D4(D1) R421.1 R421.2 U401.14(GNDA)
UX1@J401: J401.1 P403.H1(S) P403.H2(S) P403.H3(S) P403.H4(S) P403.H5(S) P403.H6(S) P403.H7(S) P403.H8(S) P403.H9(S) P403.H10(S) P403.H11(S) P403.H12(S) P403.PAD(S) R421.3 R421.4
VX2: C418.P$2 J401.2 P401.H1(S) P401.H2(S) P401.H3(S) P401.H4(S) P401.H5(S) P401.H6(S) P401.H7(S) P401.H8(S) P401.H9(S) P401.H10(S) P401.H11(S) P401.H12(S) P401.PAD(S) Q402.S1 Q402.S2(S1) Q402.S3(S1) Q402.S4(S1) Q402.S5(S1) Q406.D1 Q406.D2(D1) Q406.D3(D1) Q406.D4(D1) U402.14(GNDA)
WY1: C419.P$2 Q403.S1 Q403.S2(S1) Q403.S3(S1) Q403.S4(S1) Q403.S5(S1) Q407.D1 Q407.D2(D1) Q407.D3(D1) Q407.D4(D1) R422.1 R422.2 U403.14(GNDA)
WY1@J401: J401.3 P404.H1(S) P404.H2(S) P404.H3(S) P404.H4(S) P404.H5(S) P404.H6(S) P404.H7(S) P404.H8(S) P404.H9(S) P404.H10(S) P404.H11(S) P404.H12(S) P404.PAD(S) R422.3 R422.4
Y2: C420.P$2 J401.4 P402.H1(S) P402.H2(S) P402.H3(S) P402.H4(S) P402.H5(S) P402.H6(S) P402.H7(S) P402.H8(S) P402.H9(S) P402.H10(S) P402.H11(S) P402.H12(S) P402.PAD(S) Q404.S1 Q404.S2(S1) Q404.S3(S1) Q404.S4(S1) Q404.S5(S1) Q408.D1 Q408.D2(D1) Q408.D3(D1) Q408.D4(D1) U404.14(GNDA)

### Notes on the sheet
- 1.24v at 125ºc @ R428 = 1k13
- Power Stage

## Sheet 5 of 5: Interface
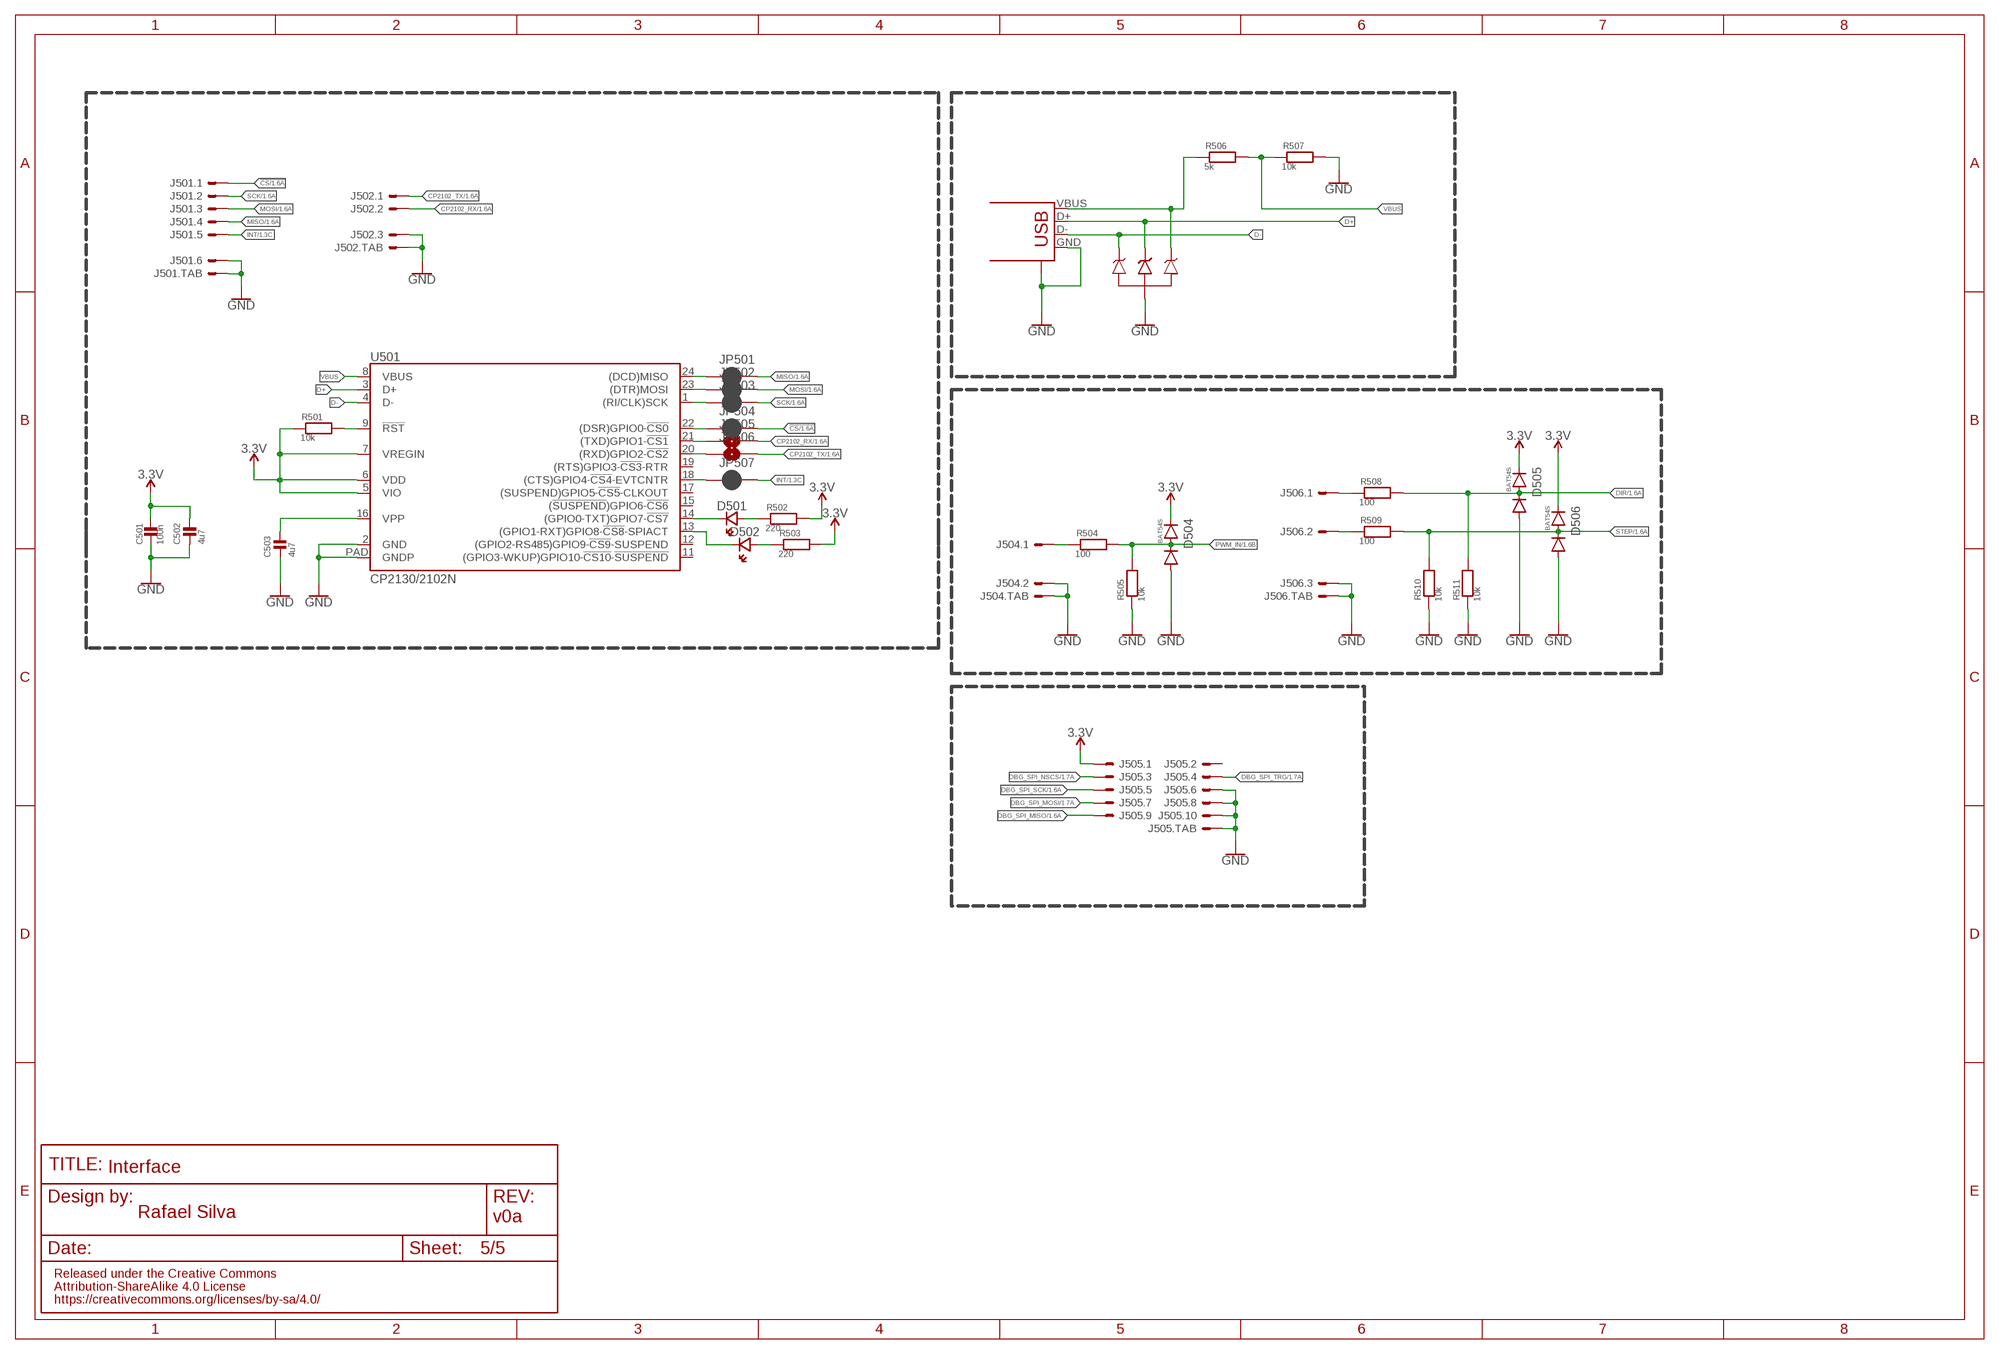
[diagram p4: schematic, sheet 5]

### Parts
C501  100n  MLCC0603  [0603_WAVE]
C502  4u7  MLCC0603  [0603_WAVE]
C503  4u7  MLCC0603  [0603_WAVE]
D501  LED0603  [CHIPLED_0603]
D502  LED0603  [CHIPLED_0603]
D503  SP0503BAHT  [SOT143]
D504  BAT54S  [SOT-23-3]
D505  BAT54S  [SOT-23-3]
D506  BAT54S  [SOT-23-3]
J501  SH-6  [SM06B-SSR-H-TB]
J502  SH-3  [SM03B-SSR-H-TB]
J503  USB-SHIELD  [USB-M-S1]
J504  SH-2  [SM02B-SSR-H-TB]
J505  F20F-10DP-1V  [F20F-10DP-1V]
J506  SH-3  [SM03B-SSR-H-TB]
JP501  JUMPER-SMT_2_NC_PASTE_SILK  [SMT-JUMPER_2_NC_PASTE_SILK]
JP502  JUMPER-SMT_2_NC_PASTE_SILK  [SMT-JUMPER_2_NC_PASTE_SILK]
JP503  JUMPER-SMT_2_NC_PASTE_SILK  [SMT-JUMPER_2_NC_PASTE_SILK]
JP504  JUMPER-SMT_2_NC_PASTE_SILK  [SMT-JUMPER_2_NC_PASTE_SILK]
JP505  JUMPER-SMT_2_NO_SILK  [SMT-JUMPER_2_NO_SILK]
JP506  JUMPER-SMT_2_NO_SILK  [SMT-JUMPER_2_NO_SILK]
JP507  JUMPER-SMT_2_NC_PASTE_SILK  [SMT-JUMPER_2_NC_PASTE_SILK]
R501  10k  RESISTOR0603  [0603_WAVE]
R502  220  RESISTOR0603  [0603_WAVE]
R503  220  RESISTOR0603  [0603_WAVE]
R504  100  RESISTOR0603  [0603_WAVE]
R505  10k  RESISTOR0603  [0603_WAVE]
R506  5k  RESISTOR0603  [0603_WAVE]
R507  10k  RESISTOR0603  [0603_WAVE]
R508  100  RESISTOR0603  [0603_WAVE]
R509  100  RESISTOR0603  [0603_WAVE]
R510  10k  RESISTOR0603  [0603_WAVE]
R511  10k  RESISTOR0603  [0603_WAVE]
U501  CP2130/2102N  [QFN24]

### Nets
3.3V: C501.P$1 C502.P$1 D504.P$2 D505.P$2 D506.P$2 J505.1 R501.P$1 R502.P$2 R503.P$2 U501.5(VIO) U501.6(VDD) U501.7(VREGIN) ; also sheet 1,2,3,4
!CS: J501.1 JP504.2 ; also sheet 1
CP2102_RX: J502.2 JP505.2 ; also sheet 1
CP2102_TX: J502.1 JP506.2 ; also sheet 1
D+: D503.3 J503.D+ U501.3(D+)
D-: D503.2 J503.D- U501.4(D-)
DBG_SPI_MISO: J505.9 ; also sheet 1
DBG_SPI_MOSI: J505.7 ; also sheet 1
DBG_SPI_NSCS: J505.3 ; also sheet 1
DBG_SPI_SCK: J505.5 ; also sheet 1
DBG_SPI_TRG: J505.4 ; also sheet 1
DIR: D505.P$3 R508.P$2 R511.P$2 ; also sheet 1
DIR@J: J506.1 R508.P$1
GND: C501.P$2 C502.P$2 C503.P$2 D503.1 D504.P$1 D505.P$1 D506.P$1 J501.6 J501.FIT@1 J501.FIT@2 J502.3 J502.FIT@1 J502.FIT@2 J503.GND J503.GND@1(CASE) J503.GND@2(CASE) J503.GND@3(CASE) J503.GND@4(CASE) J504.2 J504.FIT@1 J504.FIT@2 J505.6 J505.8 J505.10 J505.TAB1 J505.TAB2 J506.3 J506.FIT@1 J506.FIT@2 R505.P$1 R507.P$2 R510.P$1 R511.P$1 U501.2(GND) U501.PAD(GNDP) ; also sheet 1,2,3,4
INT: J501.5 JP507.2 ; also sheet 1
MISO: J501.4 JP501.2 ; also sheet 1
MOSI: J501.3 JP502.2 ; also sheet 1
N$30: D503.4 J503.VBUS R506.P$1
N$34: R501.P$2 U501.9(!RST)
N$35: C503.P$1 U501.16(VPP)
N$63: D501.C(CA) U501.14((GPIO0-TXT)GPIO7-!CS7)
N$64: D502.C(CA) U501.13((GPIO1-RXT)GPIO8-!CS8!-SPIACT)
N$65: D501.A(AN) R502.P$1
N$66: D502.A(AN) R503.P$1
N$68: JP506.1 U501.20((RXD)GPIO2-!CS2)
N$101: JP505.1 U501.21((TXD)GPIO1-!CS1)
N$106: JP507.1 U501.18((CTS)GPIO4-!CS4!-EVTCNTR)
N$108: JP504.1 U501.22((DSR)GPIO0-!CS0)
N$109: JP503.1 U501.1((RI/CLK)SCK)
N$110: JP502.1 U501.23((DTR)MOSI)
N$111: JP501.1 U501.24((DCD)MISO)
PWM_IN: D504.P$3 R504.P$2 R505.P$2 ; also sheet 1
PWM_IN@J: J504.1 R504.P$1
SCK: J501.2 JP503.2 ; also sheet 1
STEP: D506.P$3 R509.P$2 R510.P$2 ; also sheet 1
STEP@J: J506.2 R509.P$1
VBUS: R506.P$2 R507.P$1 U501.8(VBUS)
Unconnected: J505.2 U501.11((GPIO3-WKUP)GPIO10-!CS10!-!SUSPEND) U501.12((GPIO2-RS485)GPIO9-!CS9!-SUSPEND) U501.15((!SUSPEND!)GPIO6-!CS6) U501.17((SUSPEND)GPIO5-!CS5!-CLKOUT) U501.19((RTS)GPIO3-!CS3!-RTR)

### Notes on the sheet
- Interface

## Library data of the parts
C101-C118 C201-C228 C301 C305 C309 C310 C401-C432 C501-C503 = Passive Components > Capacitors > Multilayer Ceramic Capacitors MLCC:MLCC: KEMET’s X7R dielectric features a 125°C maximum operating temperature and is considered temperature stable. The Electronics Components, Assemblies and Materials Association (EIA) characterizes X7R dielectric as a Class II material. Components of this classification are fixed, ceramic dielectric capacitors suited for bypass and decoupling applications or for frequency discriminating circuits where Q and stability of capacitance characteristics are not critical. X7R exhibits a predictable change in capacitance with respect to time and voltage, boasting a minimal change in capacitance with reference to ambient temperature. Capacitance change is limited to ±15% from −55°C to +125°C.
C302-C304 C306-C308 = Passive Components > Capacitors > Aluminium Electrolytic Capacitors:CAPACITOR_EL
D101 D201-D203 D504-D506 = Semiconductors > Discrete Semiconductors > Diodes & Rectifiers > Schottky Diodes & Rectifiers:BAT54S
D301 = Semiconductors > Discrete Semiconductors > Diodes & Rectifiers > Schottky Diodes & Rectifiers:SK54L
D302 D501 D502 = Opto-electronics > LED Emitters:LED: LED 0603 - 0603 Surface Mount Package 2mA: Green LED - Low Power (3.9mcd, 2ma, 1.7Vf) - Digikey: 475-2709-2-ND Orange LED - Low Power (9.8mcd, 2ma, 1.8Vf) - Digikey: 475-1194-2-ND Red LED - Low Power (5mcd, 2ma, 1.8Vf) - Digikey: 475-1195-2-ND Yellow LED - Low Power (7mcd, 2ma, 1.8Vf) - Digikey: 475-1196-2-ND 5mA: Blue LED - Low Power (17mcd, 5ma, 2.9Vf) - Digikey: LNJ937W8CRACT-ND 0805 - 0805 Surface Mount Package 2mA: Red LED (8.8mcd, 2mA, 1.8Vf, Clear) - Low Power [Digikey: 475-2510-1-ND] Green LED (5mcd, 2mA, 1.8Vf, Clear) - Low Power [Digikey: 475-2730-1-ND] Yellow LED (11.3mcd, 2mA, 1.8Vf, Clear) - Low Power [Digikey: 475-2555-1-ND] 20mA: Red LED (104mcd, 20mA, Diffused) - LS R976 [Digikey: 475-1278-6-ND] Red LED (12mcd, 20mA, 2.0Vf, Clear) - APT2012EC [Digikey: 754-1128-1-ND] Green LED (15mcd, 20mA, 2.2Vf, Clear) - APT2012GC [Digikey: 754-1131-1-ND] Orange LED (160mcd, 20mA, 2.1Vf, Clear) - APT2012SECK [Digikey: 754-1130-1-ND] 1206 - 1206 Surface Mount Package Green LED (26mcd, 20mA, Diffused) - LG N971 [Digikey: 475-1407-6-ND] Red LED (15mcd, 20mA, Diffused) - LH N974 [Digikey: 475-1416-6-ND] Cree - Cree High-Power Surface Mount LEDs XPEBWT-L1-0000-00D50 - White 111lm 350mA 2.9Vf 6200K 110° XTEAWT-00-0000-00000LEE3 - White 114lm 350mA 2.85Vf 5000K 115° Everlight - Everlight 45-21 Series Surface Mount LEDs 45-21/QK2C-B2832AC2CB2/2T - Warm White 2000mcd 20mA 3.25Vf 3050K 120° 45-21/LK2C-B38452C4CB2/2T - Nuetral White 2000mcd 20mA 3.25Vf 4150K 120° 45-21/LK2C-B50634C6CB2/2T - Cold White 2200mcd 20mA 3.25Vf 5650K 120° PLCC2 Reverse Mount LS T77K-J1L2-1-0-2-R18-Z - Red 11.25mcd 2mA 1.8Vf 630nm 120° LO T77K-L1M2-24-Z - Orange 19.6mcd 2mA 1.8Vf 606nm 120° LY T77K-K2M1-26-Z - Yellow 15.7mcd 2mA 1.8Vf 587nm 120°
D401-D404 = Semiconductors > Discrete Semiconductors > Diodes & Rectifiers > Schottky Diodes & Rectifiers:DSK24
D503 = Circuit Protection > ESD Suppressors \ TVS Diodes:SP0503BAHT
J201-J205 = Connectors > JST > SH:SH-5
J301 J302 J403 = Connectors > Other:2P-6.35P
J401 = Connectors > Other:4P-6.35P
J402 J504 = Connectors > JST > SH:SH-2
J501 = Connectors > JST > SH:SH-6
J502 J506 = Connectors > JST > SH:SH-3
J503 = Connectors > USB:USB-SHIELD
J505 = Connectors > Other:F20F-10DP-1V
JP501-JP504 JP507 = Utility > Board:JUMPER-SMT_2_NC_PASTE: Normally closed solder jumper This jumper has an aperture in the stencil to allow solder paste to bridge the split in the wire so it's normally closed (NC). Wick off the solder to open the connection. Reapply solder to reclose the connection.
JP505 JP506 = Utility > Board:JUMPER-SMT_2_NO: Normally open jumper This jumper has two pads in close proximity to each other. Apply solder to close the connection. Round pads are easier to solder for beginners, but are a lot larger. SparkFun Product that uses the round pads: SparkFun EL Sequencer <https://www.sparkfun.com/products/12781>
L301 = Passive Components > Inductors, Chokes & Coils:INDUCTOR
P301 P302 P401-P406 = Connectors > Other:POWPAD
Q401-Q409 = Semiconductors > Discrete Semiconductors > Transistors > MOSFETs:IRF7580
R101-R121 R201-R227 R301-R305 R401-R420 R423-R426 R428-R431 R501-R511 = Passive Components > Resistors > Chip Resistors:RESISTOR: Resistors For new designs, use the packages preceded by an '_' character since they are more reliable: The following footprints should be used on most boards: _0402 - Standard footprint for regular board layouts _0603 - Standard footprint for regular board layouts _0805 - Standard footprint for regular board layouts _1206 - Standard footprint for regular board layouts For extremely tight-pitch boards where space is at a premium, the following 'micro-pitch' footprints can be used (smaller pads, no silkscreen outline, etc.): _0402MP - Micro-pitch footprint for very dense/compact boards _0603MP - Micro-pitch footprint for very dense/compact boards _0805MP - Micro-pitch footprint for very dense/compact boards _1206MP - Micro-pitch footprint for very dense/compact boards
R421 R422 = Passive Components > Resistors > Current Sense:LRMAP3920
R427 = Passive Components > Thermistors > NTC:NTC: Resistors For new designs, use the packages preceded by an '_' character since they are more reliable: The following footprints should be used on most boards: _0402 - Standard footprint for regular board layouts _0603 - Standard footprint for regular board layouts _0805 - Standard footprint for regular board layouts _1206 - Standard footprint for regular board layouts For extremely tight-pitch boards where space is at a premium, the following 'micro-pitch' footprints can be used (smaller pads, no silkscreen outline, etc.): _0402MP - Micro-pitch footprint for very dense/compact boards _0603MP - Micro-pitch footprint for very dense/compact boards _0805MP - Micro-pitch footprint for very dense/compact boards _1206MP - Micro-pitch footprint for very dense/compact boards
U101 = Eletromechanical > MEMS Oscillators:DSC1101
U102 = Power > Motor\Motion\Ignition Controllers & Drivers:TMC4671: The TMC4671 is a fully integrated servo controller, providing Field Oriented Control for BLDC/PMSM and 2-phase Stepper Motors as well as DC motors and voice coils. All control functions are implemented in hardware. Integrated ADCs, position sensor interfaces, position interpolators, enable a fully functional servo controller for a wide range of servo applications.
U201-U204 = Circuit Protection > ESD Suppressors \ TVS Diodes:SRV05-4
U205-U208 = Semiconductors > Integrated Circuits - ICs > Logic ICs > Logic Gates:74LVC3G17
U301 = Power > Switching Controllers:MIC4682
U302 U303 = Power > LDO Voltage Regulators:MIC39101: IC, LDO VOLT REG, 3.3V, 0.3A,
U401-U404 = Power > Gate Drivers:SI82397
U405 U406 = Semiconductors > Integrated Circuits - ICs > Amplifier ICs > Current Sense Amplifiers:AD8418A
U407 = Power > Gate Drivers:SI8261
U501 = Semiconductors > Integrated Circuits - ICs > Interface ICs > USB Interface IC:CP2130/2102N